# Altium schematic sheet Boost&Buck.SchDoc
size A3
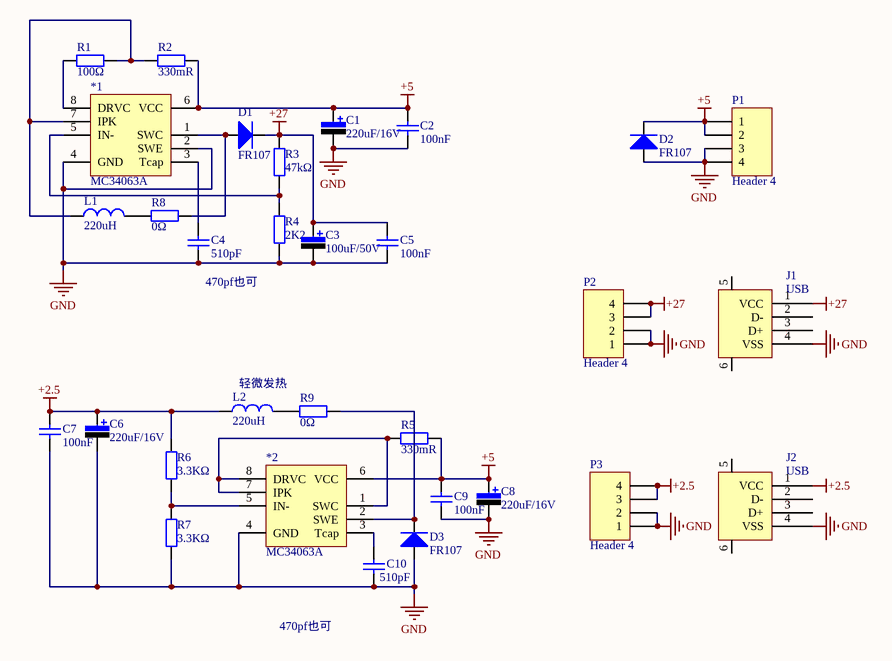
[diagram p0: Boost&Buck.SchDoc]

## Parts
*1  MC34063A  [SOP-8]
*2  MC34063A  [SOP-8]
C1  220uF/16V  [C-RB-S6]
C2  100nF  [0805_C]
C3  100uF/50V  [C-RB-S8]
C4  510pF  [0805_C]
C5  100nF  [0805_C]
C6  220uF/16V  [C-RB-S6]
C7  100nF  [0805_C]
C8  220uF/16V  [C-RB-S6]
C9  100nF  [0805_C]
C10  510pF  [0805_C]
D1  FR107  [DIODE-SMA]
D2  FR107  [DIODE-SMA]
D3  FR107  [DIODE-SMA]
J1  USB  [USB_A1]
J2  USB  [USB_A1]
L1  220uH  [CDRH104R]
L2  220uH  [CDRH104R]
P1  Header 4  [HDR1X4]
P2  Header 4  [HDR1X4]
P3  Header 4  [HDR1X4]
R1  100Ω  [0805_R]
R2  330mR  [1206_R]
R3  47kΩ  [0805_R]
R4  2K2  [0805_R]
R5  330mR  [1206_R]
R6  3.3KΩ  [0805_R]
R7  3.3KΩ  [0805_R]
R8  0Ω  [0805_R]
R9  0Ω  [0805_R]

## Nets
+2.5: C6.1 C7.1 J2.1(VCC) L2.1 P3.3 P3.4 R6.2
+5: *1.6(VCC) *2.6(VCC) C1.1 C2.1 C8.1 C9.1 D2.2(K) P1.1 P1.2 R2.2 R5.2
+27: C3.1 C5.1 D1.2(K) J1.1(VCC) P2.3 P2.4 R3.2
GND: *1.2(SWE) *1.4(GND) *2.4(GND) C1.2 C2.2 C3.2 C4.1 C5.2 C6.2 C7.2 C8.2 C9.2 C10.1 D2.1(A) D3.1(A) J1.4(VSS) J2.4(VSS) P1.3 P1.4 P2.1 P2.2 P3.1 P3.2 R4.1 R7.1
Net*1_1: *1.1(SWC) D1.1(A) R8.2
Net*1_3: *1.3(Tcap) C4.2
Net*1_5: *1.5(IN-) R3.1 R4.2
Net*1_7: *1.7(IPK) L1.1 R1.2 R2.1
Net*1_8: *1.8(DRVC) R1.1
Net*2_1: *2.1(SWC) *2.7(IPK) *2.8(DRVC) R5.1
Net*2_2: *2.2(SWE) D3.2(K) R9.2
Net*2_3: *2.3(Tcap) C10.2
Net*2_5: *2.5(IN-) R6.1 R7.2
NetL1_2: L1.2 R8.1
NetL2_2: L2.2 R9.1

Not connected (* = marked no-connect by the designer): J1 2(D-) 3(D+) 5 6; J2 2(D-) 3(D+) 5 6

## Notes on the sheet
- (near C4) 470pf也可
- (near L2) 轻微发热
- 470pf也可
- Title
- Size:
- Date:
- A3
- Number:
- Time:
- Revision:
- Sheet
- of
- File:

## Library data of the parts
C1 C3 C6 C8 = Cap Pol: 极性电解电容; Published: 8-Jun-2000; LatestRevisionDate: 17-Jul-2002; LatestRevisionNote: Re-released for DXP Platform.; PackageReference: RB7.6-15; Publisher: Altium Limited
C2 C5 C7 C9 = 0805 100nF(104) 10% 50V: 贴片电容; ComponentLink1Description: 供应商链接; ComponentLink1URL: http://www.szlcsc.com/product/details_50686.html; Package: 0805; Supplier: LC; SuppliersPartNumber: C49678
C4 C10 = 0805 470pF (471) 10% 50V: 贴片电容; ComponentLink1Description: 供应商链接; ComponentLink1URL: http://www.szlcsc.com/product/details_2095.html; Package: 0805; Supplier: LC; SuppliersPartNumber: C1743
D1-D3 = Diode: 二极管; Published: 8-Jun-2000; LatestRevisionDate: 17-Jul-2002; LatestRevisionNote: Re-released for DXP Platform.; PackageDocument: Sep-1996; PackageReference: SMC; Publisher: Altium Limited; Code_JEDEC: DO-214-AB
J1 J2 = USB: USB接口
L1 L2 = Inductor: 电感; Code_IEC: 1005; Published: 8-Jun-2000; LatestRevisionDate: 17-Jul-2002; LatestRevisionNote: Re-released for DXP Platform.; PackageReference: 0402-A; Publisher: Altium Limited; Code_JEITA: 0402
P1-P3 = Header 4: Header, 4-Pin; LatestRevisionDate: 17-Jul-2002; LatestRevisionNote: Re-released for DXP Platform.; Publisher: Altium Limited
R1 R3 R4 = 0805 100Ω (1000) 1%: 贴片电阻; ComponentLink1Description: 供应商链接; ComponentLink1URL: http://www.szlcsc.com/product/details_18096.html; Package: 0805; Supplier: LC; SuppliersPartNumber: C17408
R2 R5 = 1206 0.1Ω (R100) 1%: 贴片电阻; ComponentLink1Description: 供应商链接; ComponentLink1URL: http://www.szlcsc.com/product/details_26077.html; Package: 1206; Supplier: LC; SuppliersPartNumber: C25334
R6 R7 = 0805 3.3KΩ (3301) 1%: 贴片电阻; ComponentLink1Description: 供应商链接; ComponentLink1URL: http://www.szlcsc.com/product/details_26753.html; Package: 0805; Supplier: LC; SuppliersPartNumber: C26010
R8 R9 = 0805 0Ω (0R0) 1%: 贴片电阻; ComponentLink1Description: 供应商链接; ComponentLink1URL: http://www.szlcsc.com/product/details_18165.html; Package: 0805; Supplier: LC; SuppliersPartNumber: C17477